# EAGLE schematic erleuchtung (EAGLE 7.1.0)
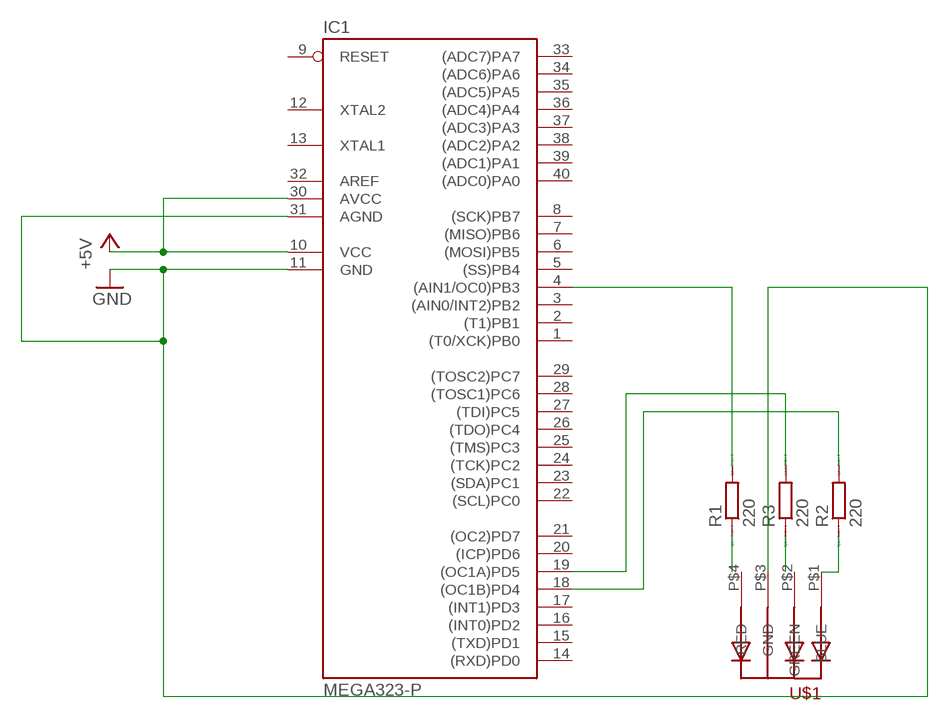
[diagram p0: schematic, sheet 1]

## Parts
IC1  MEGA323-P  [DIL40]
R1  220  R-EU_0207_5V  [0207/5V]
R2  220  R-EU_0207_5V  [0207/5V]
R3  220  R-EU_0207_5V  [0207/5V]
U$1  5MMRGBLED  [LED5MMRGB]

## Nets
+5V: IC1.10(VCC) IC1.30(AVCC)
GND: IC1.11(GND) IC1.31(AGND) U$1.P$3(GND)
N$1: R2.1 U$1.P$1(BLUE)
N$2: R3.1
N$3: R1.1
N$4: IC1.4((AIN1/OC0)PB3) R1.2
N$5: IC1.19((OC1A)PD5) R3.2
N$6: IC1.18((OC1B)PD4) R2.2
Unconnected: IC1.1((T0/XCK)PB0) IC1.2((T1)PB1) IC1.3((AIN0/INT2)PB2) IC1.5((SS)PB4) IC1.6((MOSI)PB5) IC1.7((MISO)PB6) IC1.8((SCK)PB7) IC1.9(RESET) IC1.12(XTAL2) IC1.13(XTAL1) IC1.14((RXD)PD0) IC1.15((TXD)PD1) IC1.16((INT0)PD2) IC1.17((INT1)PD3) IC1.20((ICP)PD6) IC1.21((OC2)PD7) IC1.22((SCL)PC0) IC1.23((SDA)PC1) IC1.24((TCK)PC2) IC1.25((TMS)PC3) IC1.26((TDO)PC4) IC1.27((TDI)PC5) IC1.28((TOSC1)PC6) IC1.29((TOSC2)PC7) IC1.32(AREF) IC1.33((ADC7)PA7) IC1.34((ADC6)PA6) IC1.35((ADC5)PA5) IC1.36((ADC4)PA4) IC1.37((ADC3)PA3) IC1.38((ADC2)PA2) IC1.39((ADC1)PA1) IC1.40((ADC0)PA0) U$1.P$2(GREEN) U$1.P$4(RED)

## Library data of the parts
IC1 = atmel:MEGA323-P: MICROCONTROLLER 32 Kbytes FLASH 2 Kbytes SRAM 1 Kbytes EEPROM USART 8-channel 10 bit ADC Source: avr.lbr; OC_FARNELL: unknown; OC_NEWARK: unknown
R1-R3 = resistor:R-EU_: RESISTOR, European symbol; SPICEPREFIX: R
U$1 = led_rgb:5MMRGBLED